# Altium schematic sheet VCTS_Mainboard.SchDoc
size B; SheetNumber: 1; SheetTotal: 16
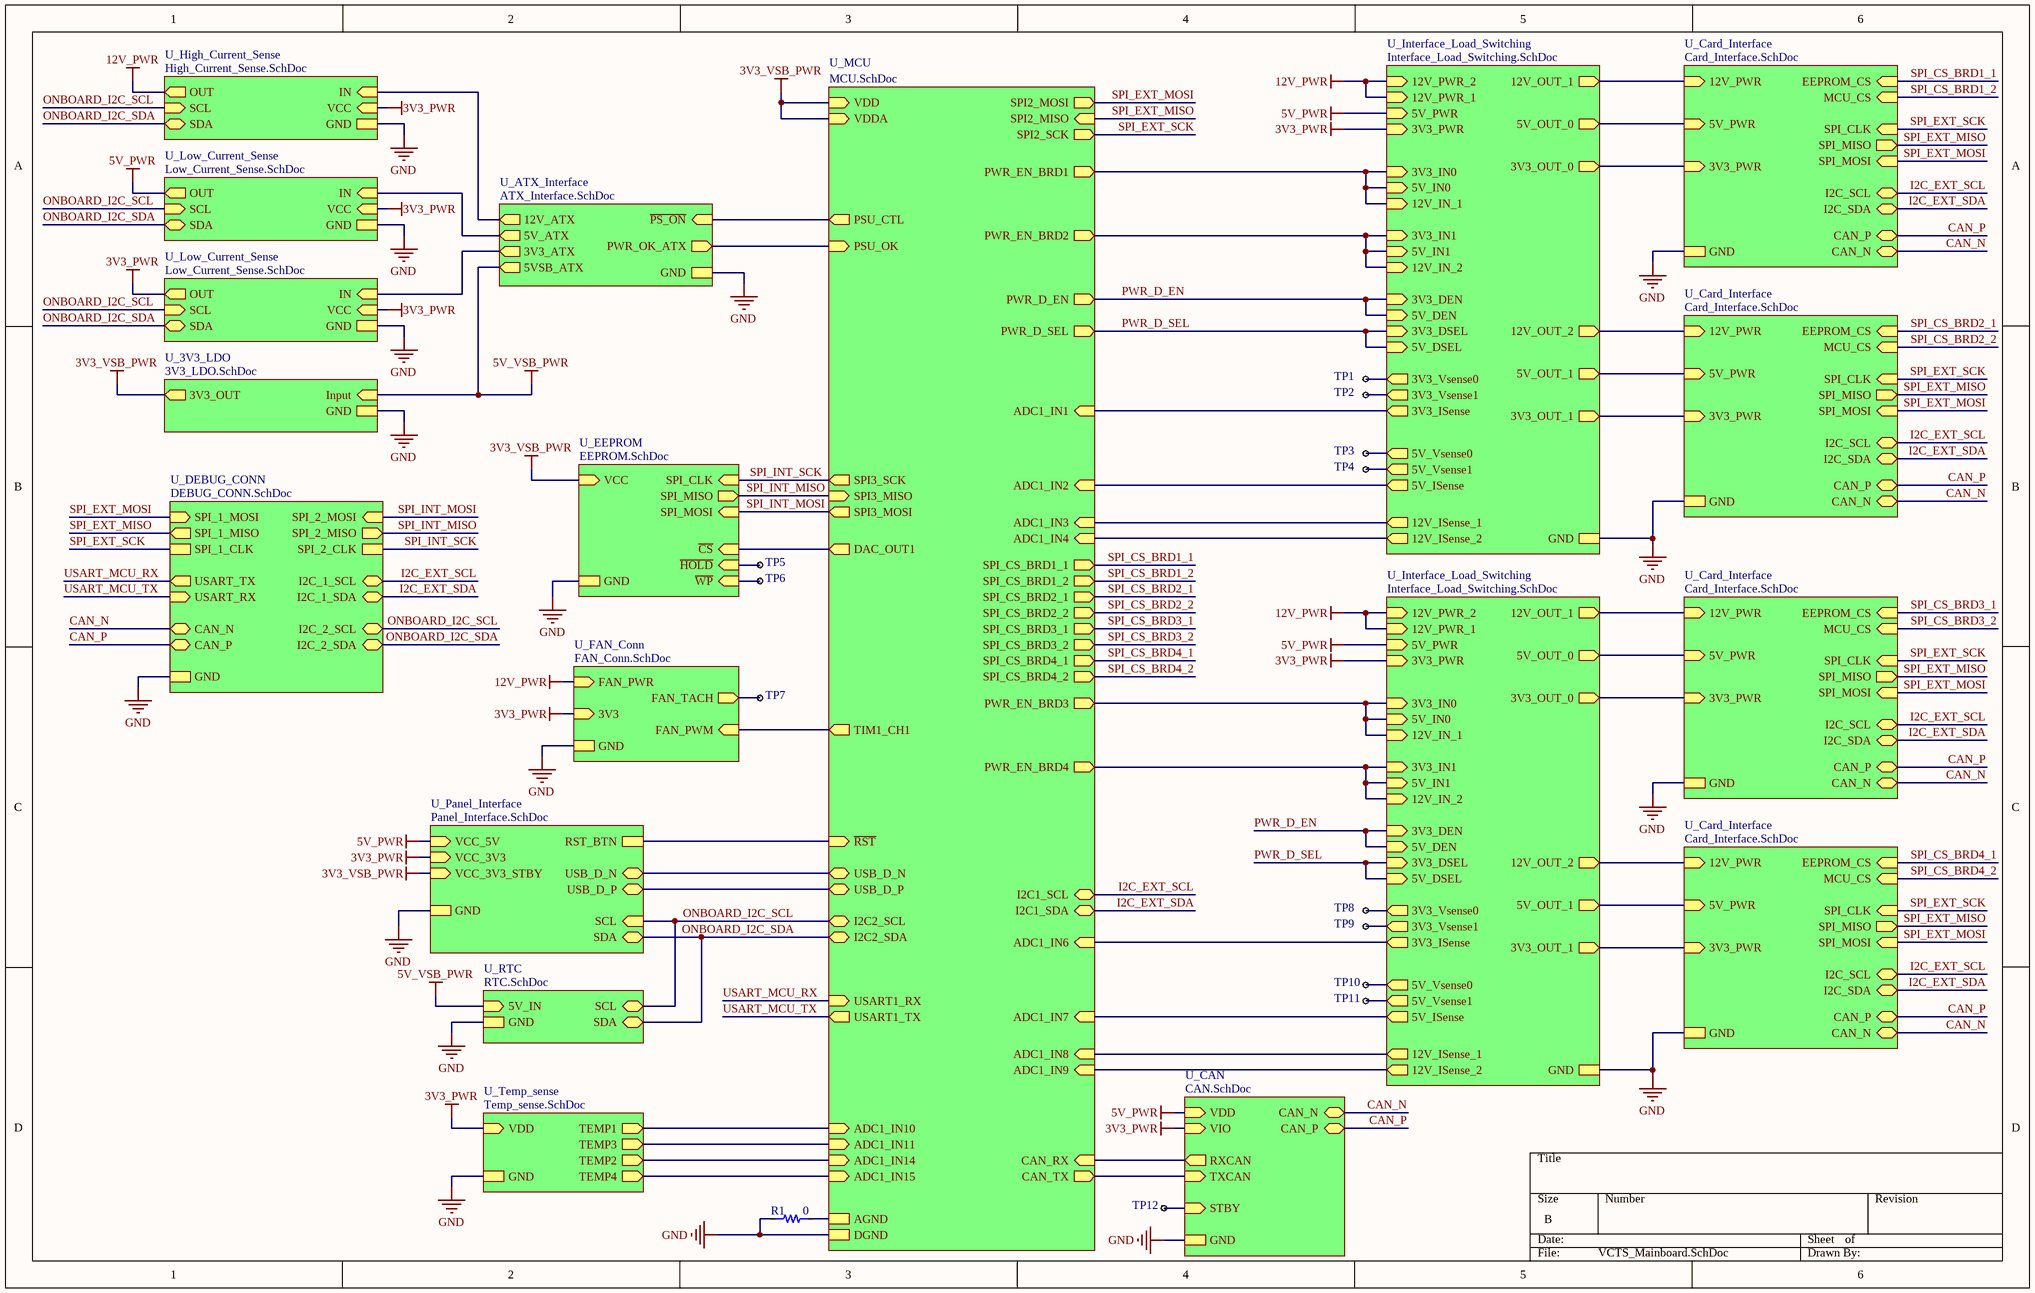
[diagram p0: VCTS_Mainboard.SchDoc]

## Parts
R1  value 0  [0603_RES]  (hidden comment: Resistor)
TP1  1mm Testpoint  [1mm_testpoint]  (value not drawn)
TP2  1mm Testpoint  [1mm_testpoint]  (value not drawn)
TP3  1mm Testpoint  [1mm_testpoint]  (value not drawn)
TP4  1mm Testpoint  [1mm_testpoint]  (value not drawn)
TP5  1mm Testpoint  [1mm_testpoint]  (value not drawn)
TP6  1mm Testpoint  [1mm_testpoint]  (value not drawn)
TP7  1mm Testpoint  [1mm_testpoint]  (value not drawn)
TP8  1mm Testpoint  [1mm_testpoint]  (value not drawn)
TP9  1mm Testpoint  [1mm_testpoint]  (value not drawn)
TP10  1mm Testpoint  [1mm_testpoint]  (value not drawn)
TP11  1mm Testpoint  [1mm_testpoint]  (value not drawn)
TP12  1mm Testpoint  [1mm_testpoint]  (value not drawn)

## Sub-sheets
U_3V3_LDO = 3V3_LDO.SchDoc: Input (in), GND, 3V3_OUT (out)
U_ATX_Interface = ATX_Interface.SchDoc: 12V_ATX (out), 5V_ATX (out), 5VSB_ATX (out), 3V3_ATX (out), PWR_OK_ATX (out), ~{PS_ON} (in), GND
U_CAN = CAN.SchDoc: GND, CAN_N (bidir), CAN_P (bidir), TXCAN (in), RXCAN (out), VDD (in), VIO (in), STBY (in)
U_Card_Interface = Card_Interface.SchDoc: 12V_PWR (in), 5V_PWR (in), 3V3_PWR (in), GND, EEPROM_CS (in), MCU_CS (in), I2C_SDA (bidir), I2C_SCL (bidir), SPI_CLK (in), SPI_MOSI (in), SPI_MISO (out), CAN_P (bidir), CAN_N (bidir)
U_Card_Interface = Card_Interface.SchDoc: 12V_PWR (in), 5V_PWR (in), 3V3_PWR (in), GND, EEPROM_CS (in), MCU_CS (in), I2C_SDA (bidir), I2C_SCL (bidir), SPI_CLK (in), SPI_MOSI (in), SPI_MISO (out), CAN_P (bidir), CAN_N (bidir)
U_Card_Interface = Card_Interface.SchDoc: 12V_PWR (in), 5V_PWR (in), 3V3_PWR (in), GND, EEPROM_CS (in), MCU_CS (in), I2C_SDA (bidir), I2C_SCL (bidir), SPI_CLK (in), SPI_MOSI (in), SPI_MISO (out), CAN_P (bidir), CAN_N (bidir)
U_Card_Interface = Card_Interface.SchDoc: 12V_PWR (in), 5V_PWR (in), 3V3_PWR (in), GND, EEPROM_CS (in), MCU_CS (in), I2C_SDA (bidir), I2C_SCL (bidir), SPI_CLK (in), SPI_MOSI (in), SPI_MISO (out), CAN_P (bidir), CAN_N (bidir)
U_DEBUG_CONN = DEBUG_CONN.SchDoc: SPI_1_MOSI (in), SPI_1_MISO (out), SPI_1_CLK, I2C_2_SCL (bidir), I2C_2_SDA (bidir), SPI_2_MISO (out), GND, SPI_2_MOSI (in), SPI_2_CLK, USART_RX (in), USART_TX (out), CAN_N (bidir), CAN_P (bidir), I2C_1_SCL (bidir), I2C_1_SDA (bidir)
U_EEPROM = EEPROM.SchDoc: ~{CS} (in), ~{HOLD} (in), ~{WP} (in), VCC (in), GND, SPI_MISO (out), SPI_MOSI (in), SPI_CLK (in)
U_FAN_Conn = FAN_Conn.SchDoc: FAN_PWR (in), GND, FAN_PWM (in), FAN_TACH (out), 3V3 (in)
U_High_Current_Sense = High_Current_Sense.SchDoc: VCC (in), SCL (in), SDA (bidir), IN (in), OUT (out), GND
U_Interface_Load_Switching = Interface_Load_Switching.SchDoc: 5V_IN0 (in), 5V_DEN (in), 5V_DSEL (in), 5V_IN1 (in), GND, 5V_OUT_1 (out), 5V_PWR (in), 5V_OUT_0 (out), 3V3_IN0 (in), 3V3_DEN (in), 3V3_DSEL (in), 3V3_IN1 (in), 3V3_OUT_1 (out), 3V3_PWR (in), 3V3_OUT_0 (out), 12V_PWR_1 (in), 12V_IN_1 (in), 12V_OUT_1 (out), 12V_PWR_2 (in), 12V_IN_2 (in), 12V_OUT_2 (out), 5V_ISense (out), 5V_Vsense0 (out), 5V_Vsense1 (out), 3V3_ISense (out), 3V3_Vsense0 (out), 3V3_Vsense1 (out), 12V_ISense_1 (out), 12V_ISense_2 (out)
U_Interface_Load_Switching = Interface_Load_Switching.SchDoc: 5V_IN0 (in), 5V_DEN (in), 5V_DSEL (in), 5V_IN1 (in), GND, 5V_OUT_1 (out), 5V_PWR (in), 5V_OUT_0 (out), 3V3_IN0 (in), 3V3_DEN (in), 3V3_DSEL (in), 3V3_IN1 (in), 3V3_OUT_1 (out), 3V3_PWR (in), 3V3_OUT_0 (out), 12V_PWR_1 (in), 12V_IN_1 (in), 12V_OUT_1 (out), 12V_PWR_2 (in), 12V_IN_2 (in), 12V_OUT_2 (out), 5V_ISense (out), 5V_Vsense0 (out), 5V_Vsense1 (out), 3V3_ISense (out), 3V3_Vsense0 (out), 3V3_Vsense1 (out), 12V_ISense_1 (out), 12V_ISense_2 (out)
U_Low_Current_Sense = Low_Current_Sense.SchDoc: VCC (in), SCL (in), SDA (bidir), IN (in), OUT (out), GND
U_Low_Current_Sense = Low_Current_Sense.SchDoc: VCC (in), SCL (in), SDA (bidir), IN (in), OUT (out), GND
U_MCU = MCU.SchDoc: SPI3_MISO (in), USART1_RX (in), VDD (in), VDDA (in), ADC1_IN1 (in), ADC1_IN2 (in), ADC1_IN3 (in), ADC1_IN4 (in), ADC1_IN6 (in), ADC1_IN7 (in), ADC1_IN8 (in), ADC1_IN9 (in), PWR_EN_BRD1 (out), PWR_EN_BRD2 (out), PWR_EN_BRD3 (out), PWR_EN_BRD4 (out), PWR_D_EN (out), PWR_D_SEL (out), SPI3_MOSI (out), SPI3_SCK (out), CAN_TX (out), USART1_TX (out), CAN_RX (in), SPI_CS_BRD2_1 (out), SPI_CS_BRD2_2 (out), SPI_CS_BRD3_1 (out), SPI_CS_BRD3_2 (out), SPI_CS_BRD4_1 (out), SPI_CS_BRD4_2 (out), ~{RST} (in), I2C2_SCL (bidir), I2C2_SDA (bidir), TIM1_CH1 (out), DAC_OUT1 (out), ADC1_IN10 (in), ADC1_IN15 (in), ADC1_IN11 (in), ADC1_IN14 (in), USB_D_P (bidir), USB_D_N (bidir), PSU_OK (in), PSU_CTL (out), SPI2_MOSI (out), SPI2_SCK (out), SPI2_MISO (in), AGND, DGND, I2C1_SDA (bidir), I2C1_SCL (bidir), SPI_CS_BRD1_1 (out), SPI_CS_BRD1_2 (out)
U_Panel_Interface = Panel_Interface.SchDoc: SDA (bidir), SCL (in), RST_BTN, VCC_3V3_STBY (in), VCC_3V3 (in), USB_D_N (bidir), USB_D_P (bidir), VCC_5V (in), GND
U_RTC = RTC.SchDoc: 5V_IN (in), SCL (bidir), SDA (bidir), GND
U_Temp_sense = Temp_sense.SchDoc: VDD (in), GND, TEMP1 (out), TEMP3 (out), TEMP2 (out), TEMP4 (out)

## Nets
3V3_PWR: sheet U_CAN/VIO, sheet U_Temp_sense/VDD, sheet U_High_Current_Sense/VCC, sheet U_Panel_Interface/VCC_3V3, sheet U_FAN_Conn/3V3, sheet U_Interface_Load_Switching/3V3_PWR, sheet U_Low_Current_Sense/VCC, sheet U_Low_Current_Sense/VCC, sheet U_Low_Current_Sense/OUT, sheet U_Interface_Load_Switching/3V3_PWR
3V3_VSB_PWR: sheet U_MCU/VDD, sheet U_MCU/VDDA, sheet U_EEPROM/VCC, sheet U_Panel_Interface/VCC_3V3_STBY, sheet U_3V3_LDO/3V3_OUT
5V_PWR: sheet U_CAN/VDD, sheet U_Panel_Interface/VCC_5V, sheet U_Interface_Load_Switching/5V_PWR, sheet U_Low_Current_Sense/OUT, sheet U_Interface_Load_Switching/5V_PWR
5V_VSB_PWR: sheet U_RTC/5V_IN, sheet U_ATX_Interface/5VSB_ATX, sheet U_3V3_LDO/Input
12V_PWR: sheet U_High_Current_Sense/OUT, sheet U_FAN_Conn/FAN_PWR, sheet U_Interface_Load_Switching/12V_PWR_1, sheet U_Interface_Load_Switching/12V_PWR_2, sheet U_Interface_Load_Switching/12V_PWR_1, sheet U_Interface_Load_Switching/12V_PWR_2
GND: R1.1 ; sheet U_MCU/DGND, sheet U_CAN/GND, sheet U_RTC/GND, sheet U_Temp_sense/GND, sheet U_High_Current_Sense/GND, sheet U_ATX_Interface/GND, sheet U_EEPROM/GND, sheet U_Card_Interface/GND, sheet U_Panel_Interface/GND, sheet U_FAN_Conn/GND, sheet U_Interface_Load_Switching/GND, sheet U_3V3_LDO/GND, sheet U_Low_Current_Sense/GND, sheet U_Low_Current_Sense/GND, sheet U_Card_Interface/GND, sheet U_Card_Interface/GND, sheet U_Interface_Load_Switching/GND, sheet U_Card_Interface/GND, sheet U_DEBUG_CONN/GND
CAN_N: sheet U_CAN/CAN_N, sheet U_Card_Interface/CAN_N, sheet U_Card_Interface/CAN_N, sheet U_Card_Interface/CAN_N, sheet U_Card_Interface/CAN_N, sheet U_DEBUG_CONN/CAN_N
CAN_P: sheet U_CAN/CAN_P, sheet U_Card_Interface/CAN_P, sheet U_Card_Interface/CAN_P, sheet U_Card_Interface/CAN_P, sheet U_Card_Interface/CAN_P, sheet U_DEBUG_CONN/CAN_P
I2C_EXT_SCL: sheet U_MCU/I2C1_SCL, sheet U_Card_Interface/I2C_SCL, sheet U_Card_Interface/I2C_SCL, sheet U_Card_Interface/I2C_SCL, sheet U_Card_Interface/I2C_SCL, sheet U_DEBUG_CONN/I2C_1_SCL
I2C_EXT_SDA: sheet U_MCU/I2C1_SDA, sheet U_Card_Interface/I2C_SDA, sheet U_Card_Interface/I2C_SDA, sheet U_Card_Interface/I2C_SDA, sheet U_Card_Interface/I2C_SDA, sheet U_DEBUG_CONN/I2C_1_SDA
ONBOARD_I2C_SCL: sheet U_MCU/I2C2_SCL, sheet U_RTC/SCL, sheet U_High_Current_Sense/SCL, sheet U_Panel_Interface/SCL, sheet U_Low_Current_Sense/SCL, sheet U_Low_Current_Sense/SCL, sheet U_DEBUG_CONN/I2C_2_SCL
ONBOARD_I2C_SDA: sheet U_MCU/I2C2_SDA, sheet U_RTC/SDA, sheet U_High_Current_Sense/SDA, sheet U_Panel_Interface/SDA, sheet U_Low_Current_Sense/SDA, sheet U_Low_Current_Sense/SDA, sheet U_DEBUG_CONN/I2C_2_SDA
PWR_D_EN: sheet U_MCU/PWR_D_EN, sheet U_Interface_Load_Switching/5V_DEN, sheet U_Interface_Load_Switching/3V3_DEN, sheet U_Interface_Load_Switching/5V_DEN, sheet U_Interface_Load_Switching/3V3_DEN
PWR_D_SEL: sheet U_MCU/PWR_D_SEL, sheet U_Interface_Load_Switching/5V_DSEL, sheet U_Interface_Load_Switching/3V3_DSEL, sheet U_Interface_Load_Switching/5V_DSEL, sheet U_Interface_Load_Switching/3V3_DSEL
SPI_CS_BRD1_1: sheet U_MCU/SPI_CS_BRD1_1, sheet U_Card_Interface/EEPROM_CS
SPI_CS_BRD1_2: sheet U_MCU/SPI_CS_BRD1_2, sheet U_Card_Interface/MCU_CS
SPI_CS_BRD2_1: sheet U_MCU/SPI_CS_BRD2_1, sheet U_Card_Interface/EEPROM_CS
SPI_CS_BRD2_2: sheet U_MCU/SPI_CS_BRD2_2, sheet U_Card_Interface/MCU_CS
SPI_CS_BRD3_1: sheet U_MCU/SPI_CS_BRD3_1, sheet U_Card_Interface/EEPROM_CS
SPI_CS_BRD3_2: sheet U_MCU/SPI_CS_BRD3_2, sheet U_Card_Interface/MCU_CS
SPI_CS_BRD4_1: sheet U_MCU/SPI_CS_BRD4_1, sheet U_Card_Interface/EEPROM_CS
SPI_CS_BRD4_2: sheet U_MCU/SPI_CS_BRD4_2, sheet U_Card_Interface/MCU_CS
SPI_EXT_MISO: sheet U_MCU/SPI2_MISO, sheet U_Card_Interface/SPI_MISO, sheet U_Card_Interface/SPI_MISO, sheet U_Card_Interface/SPI_MISO, sheet U_Card_Interface/SPI_MISO, sheet U_DEBUG_CONN/SPI_1_MISO
SPI_EXT_MOSI: sheet U_MCU/SPI2_MOSI, sheet U_Card_Interface/SPI_MOSI, sheet U_Card_Interface/SPI_MOSI, sheet U_Card_Interface/SPI_MOSI, sheet U_Card_Interface/SPI_MOSI, sheet U_DEBUG_CONN/SPI_1_MOSI
SPI_EXT_SCK: sheet U_MCU/SPI2_SCK, sheet U_Card_Interface/SPI_CLK, sheet U_Card_Interface/SPI_CLK, sheet U_Card_Interface/SPI_CLK, sheet U_Card_Interface/SPI_CLK, sheet U_DEBUG_CONN/SPI_1_CLK
SPI_INT_MISO: sheet U_MCU/SPI3_MISO, sheet U_EEPROM/SPI_MISO, sheet U_DEBUG_CONN/SPI_2_MISO
SPI_INT_MOSI: sheet U_MCU/SPI3_MOSI, sheet U_EEPROM/SPI_MOSI, sheet U_DEBUG_CONN/SPI_2_MOSI
SPI_INT_SCK: sheet U_MCU/SPI3_SCK, sheet U_EEPROM/SPI_CLK, sheet U_DEBUG_CONN/SPI_2_CLK
USART_MCU_RX: sheet U_MCU/USART1_RX, sheet U_DEBUG_CONN/USART_TX
USART_MCU_TX: sheet U_MCU/USART1_TX, sheet U_DEBUG_CONN/USART_RX
NetR1_2: R1.2 ; sheet U_MCU/AGND
NetTP1_1: TP1.1 ; sheet U_Interface_Load_Switching/3V3_Vsense0
NetTP2_1: TP2.1 ; sheet U_Interface_Load_Switching/3V3_Vsense1
NetTP3_1: TP3.1 ; sheet U_Interface_Load_Switching/5V_Vsense0
NetTP4_1: TP4.1 ; sheet U_Interface_Load_Switching/5V_Vsense1
NetTP5_1: TP5.1 ; sheet U_EEPROM/~{HOLD}
NetTP6_1: TP6.1 ; sheet U_EEPROM/~{WP}
NetTP7_1: TP7.1 ; sheet U_FAN_Conn/FAN_TACH
NetTP8_1: TP8.1 ; sheet U_Interface_Load_Switching/3V3_Vsense0
NetTP9_1: TP9.1 ; sheet U_Interface_Load_Switching/3V3_Vsense1
NetTP10_1: TP10.1 ; sheet U_Interface_Load_Switching/5V_Vsense0
NetTP11_1: TP11.1 ; sheet U_Interface_Load_Switching/5V_Vsense1
NetTP12_1: TP12.1 ; sheet U_CAN/STBY
(unnamed): sheet U_MCU/ADC1_IN1, sheet U_Interface_Load_Switching/3V3_ISense
(unnamed): sheet U_MCU/ADC1_IN2, sheet U_Interface_Load_Switching/5V_ISense
(unnamed): sheet U_MCU/ADC1_IN3, sheet U_Interface_Load_Switching/12V_ISense_1
(unnamed): sheet U_MCU/ADC1_IN4, sheet U_Interface_Load_Switching/12V_ISense_2
(unnamed): sheet U_MCU/ADC1_IN6, sheet U_Interface_Load_Switching/3V3_ISense
(unnamed): sheet U_MCU/ADC1_IN7, sheet U_Interface_Load_Switching/5V_ISense
(unnamed): sheet U_MCU/ADC1_IN8, sheet U_Interface_Load_Switching/12V_ISense_1
(unnamed): sheet U_MCU/ADC1_IN9, sheet U_Interface_Load_Switching/12V_ISense_2
(unnamed): sheet U_MCU/PWR_EN_BRD1, sheet U_Interface_Load_Switching/5V_IN0, sheet U_Interface_Load_Switching/3V3_IN0, sheet U_Interface_Load_Switching/12V_IN_1
(unnamed): sheet U_MCU/PWR_EN_BRD2, sheet U_Interface_Load_Switching/5V_IN1, sheet U_Interface_Load_Switching/3V3_IN1, sheet U_Interface_Load_Switching/12V_IN_2
(unnamed): sheet U_MCU/PWR_EN_BRD3, sheet U_Interface_Load_Switching/5V_IN0, sheet U_Interface_Load_Switching/3V3_IN0, sheet U_Interface_Load_Switching/12V_IN_1
(unnamed): sheet U_MCU/PWR_EN_BRD4, sheet U_Interface_Load_Switching/5V_IN1, sheet U_Interface_Load_Switching/3V3_IN1, sheet U_Interface_Load_Switching/12V_IN_2
(unnamed): sheet U_MCU/CAN_TX, sheet U_CAN/TXCAN
(unnamed): sheet U_MCU/CAN_RX, sheet U_CAN/RXCAN
(unnamed): sheet U_MCU/~{RST}, sheet U_Panel_Interface/RST_BTN
(unnamed): sheet U_MCU/TIM1_CH1, sheet U_FAN_Conn/FAN_PWM
(unnamed): sheet U_MCU/DAC_OUT1, sheet U_EEPROM/~{CS}
(unnamed): sheet U_MCU/ADC1_IN10, sheet U_Temp_sense/TEMP1
(unnamed): sheet U_MCU/ADC1_IN15, sheet U_Temp_sense/TEMP4
(unnamed): sheet U_MCU/ADC1_IN11, sheet U_Temp_sense/TEMP3
(unnamed): sheet U_MCU/ADC1_IN14, sheet U_Temp_sense/TEMP2
(unnamed): sheet U_MCU/USB_D_P, sheet U_Panel_Interface/USB_D_P
(unnamed): sheet U_MCU/USB_D_N, sheet U_Panel_Interface/USB_D_N
(unnamed): sheet U_MCU/PSU_OK, sheet U_ATX_Interface/PWR_OK_ATX
(unnamed): sheet U_MCU/PSU_CTL, sheet U_ATX_Interface/~{PS_ON}
(unnamed): sheet U_High_Current_Sense/IN, sheet U_ATX_Interface/12V_ATX
(unnamed): sheet U_ATX_Interface/5V_ATX, sheet U_Low_Current_Sense/IN
(unnamed): sheet U_ATX_Interface/3V3_ATX, sheet U_Low_Current_Sense/IN
(unnamed): sheet U_Card_Interface/12V_PWR, sheet U_Interface_Load_Switching/12V_OUT_1
(unnamed): sheet U_Card_Interface/5V_PWR, sheet U_Interface_Load_Switching/5V_OUT_0
(unnamed): sheet U_Card_Interface/3V3_PWR, sheet U_Interface_Load_Switching/3V3_OUT_0
(unnamed): sheet U_Interface_Load_Switching/5V_OUT_1, sheet U_Card_Interface/5V_PWR
(unnamed): sheet U_Interface_Load_Switching/3V3_OUT_1, sheet U_Card_Interface/3V3_PWR
(unnamed): sheet U_Interface_Load_Switching/12V_OUT_2, sheet U_Card_Interface/12V_PWR
(unnamed): sheet U_Card_Interface/12V_PWR, sheet U_Interface_Load_Switching/12V_OUT_1
(unnamed): sheet U_Card_Interface/5V_PWR, sheet U_Interface_Load_Switching/5V_OUT_0
(unnamed): sheet U_Card_Interface/3V3_PWR, sheet U_Interface_Load_Switching/3V3_OUT_0
(unnamed): sheet U_Interface_Load_Switching/5V_OUT_1, sheet U_Card_Interface/5V_PWR
(unnamed): sheet U_Interface_Load_Switching/3V3_OUT_1, sheet U_Card_Interface/3V3_PWR
(unnamed): sheet U_Interface_Load_Switching/12V_OUT_2, sheet U_Card_Interface/12V_PWR

## Library data of the parts
TP1-TP12 = 1mm Testpoint: 1mm test point; ComponentLink1Description: Digikey; ComponentLink1URL: https://www.digikey.com/product-detail/en/te-connectivity-amp-connectors/RCU-0C/A106145CT-ND/3477802
R1 = Resistor: Tolerance: *